# EAGLE design BeeBeeAte-BotBoardV2 (EAGLE 9.6.2)

## Sheet 1 of 4: Power Supply
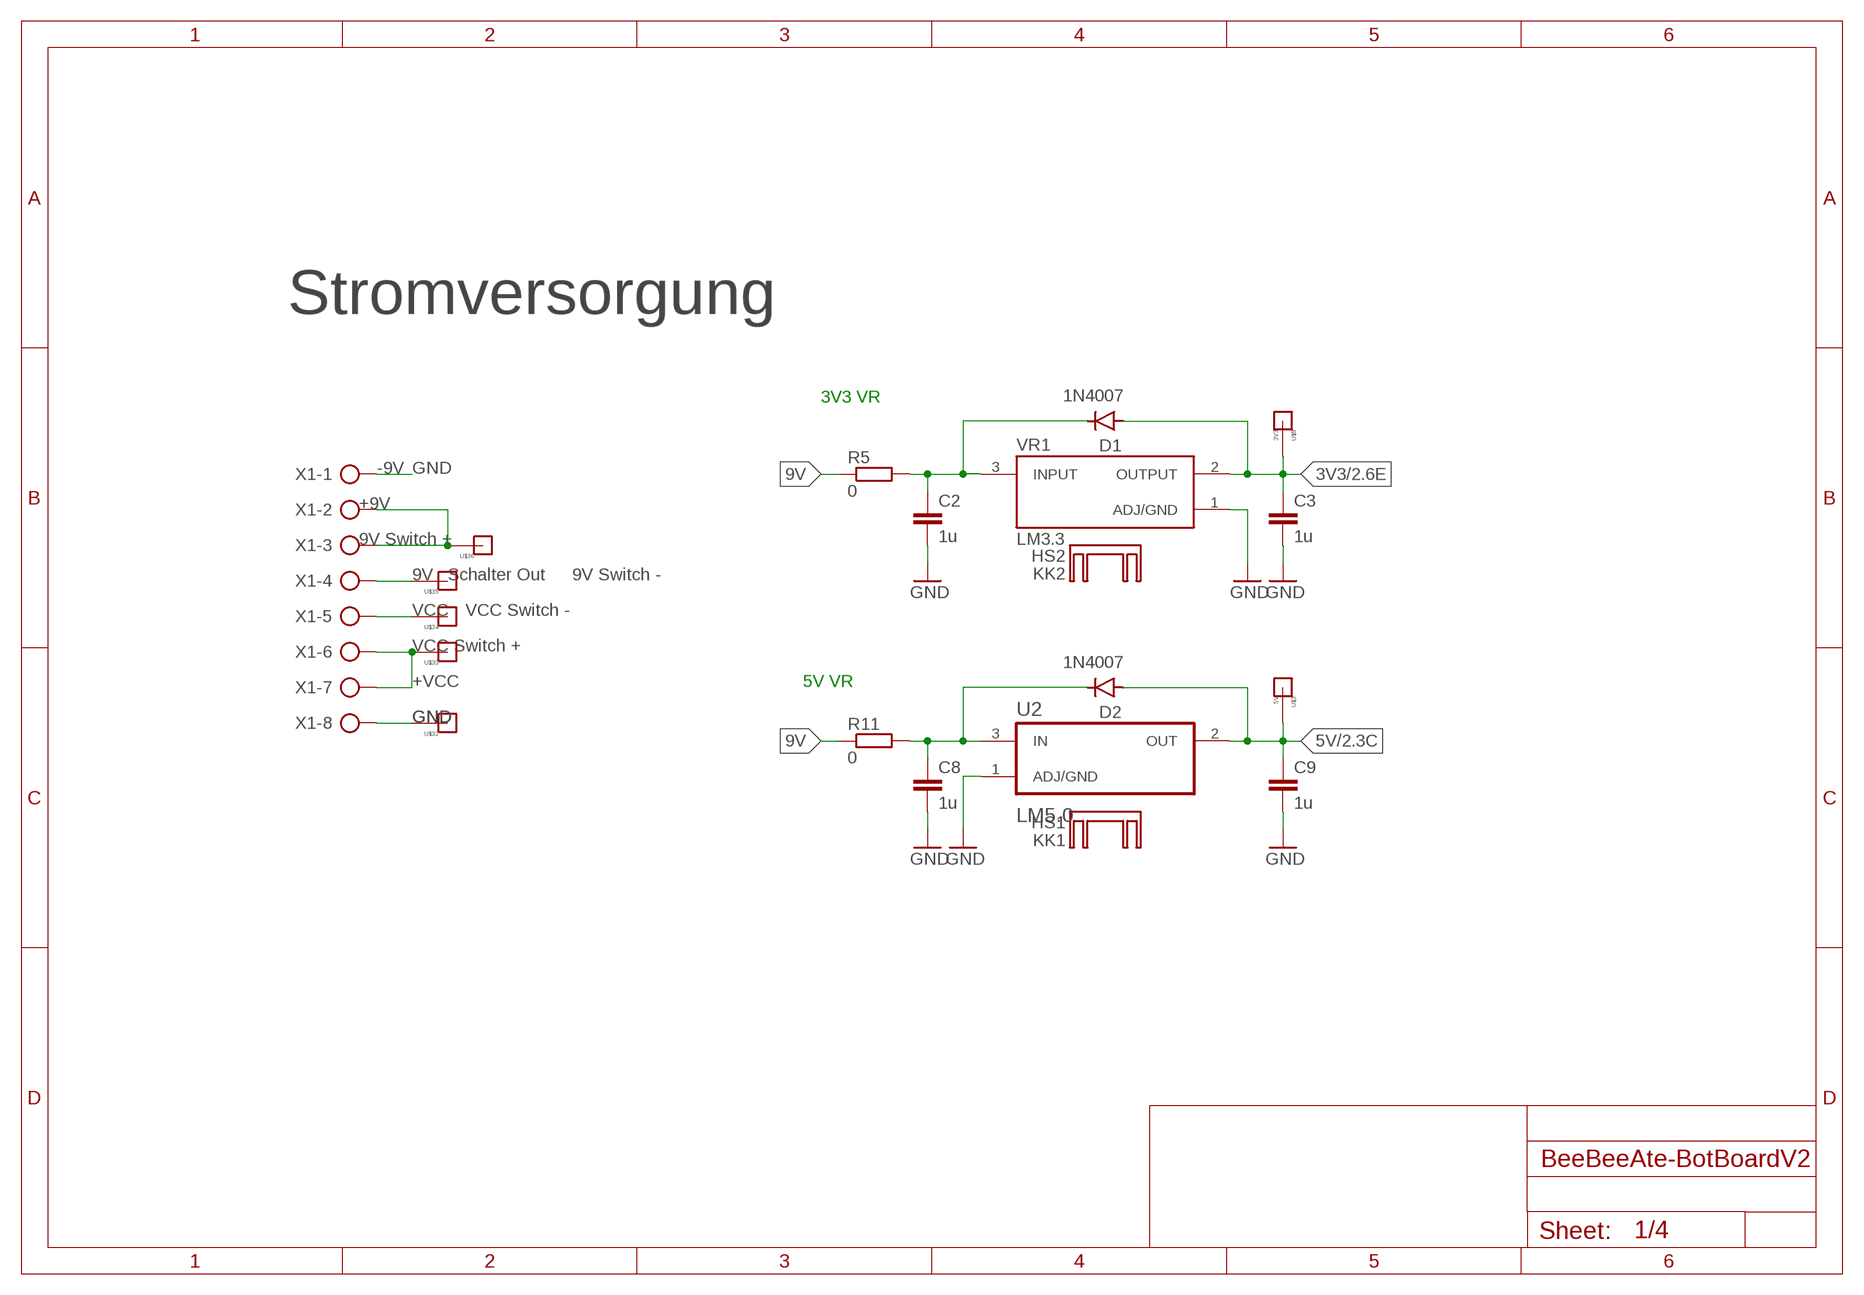
[diagram p0: schematic, sheet 1]

### Parts
C2  1u  C-EUC0805  [C0805]
C3  1u  C-EUC0805  [C0805]
C8  1u  C-EUC0805  [C0805]
C9  1u  C-EUC0805  [C0805]
D1  1N4007  [DO-41]
D2  1N4007  [DO-41]
KK1  HS1  SK95-2M3  [SK95-2M3]
KK2  HS2  SK95-2M3  [SK95-2M3]
R5  0  R-EU_R0805  [R0805]
R11  0  R-EU_R0805  [R0805]
U2  LM5.0  LM1117T-5.0  [TO254P1054X470X1955-3]
U$3  5V  MESSPAD  [MESSPAD]
U$5  3V3  MESSPAD  [MESSPAD]
U$32  MESSPAD  [MESSPAD]
U$33  MESSPAD  [MESSPAD]
U$34  MESSPAD  [MESSPAD]
U$35  MESSPAD  [MESSPAD]
U$36  MESSPAD  [MESSPAD]
VR1  LM3.3  LM1117T-3.3/NOPB  [TO254P1054X470X1955-3]
X1  +9V  AK300/8  [AK300/8]

### Nets
3V3: C3.1 D1.A U$5.MSP VR1.2(OUTPUT) ; also sheet 2,3,4
5V: C9.1 D2.A U2.2(OUT) U$3.MSP ; also sheet 2
9V: R5.1 R11.1 U$35.MSP X1.4
+VCC: U$33.MSP X1.6 X1.7
GND: C2.2 C3.2 C8.2 C9.2 U2.1(ADJ/GND) U$32.MSP VR1.1(ADJ/GND) X1.1 X1.8 ; also sheet 2,3,4
N$4: C2.1 D1.C R5.2 VR1.3(INPUT)
N$8: C8.1 D2.C R11.2 U2.3(IN)
N$46: U$36.MSP X1.2 X1.3
VCC: U$34.MSP X1.5 ; also sheet 3

### Notes on the sheet
- Stromversorgung
- 3V3 VR
- -9V
- +9V
- 9V Switch +
- Schalter Out | 9V Switch -
- VCC Switch -
- VCC Switch +
- +VCC | 5V VR

## Sheet 2 of 4: ESP32 und USB Modul
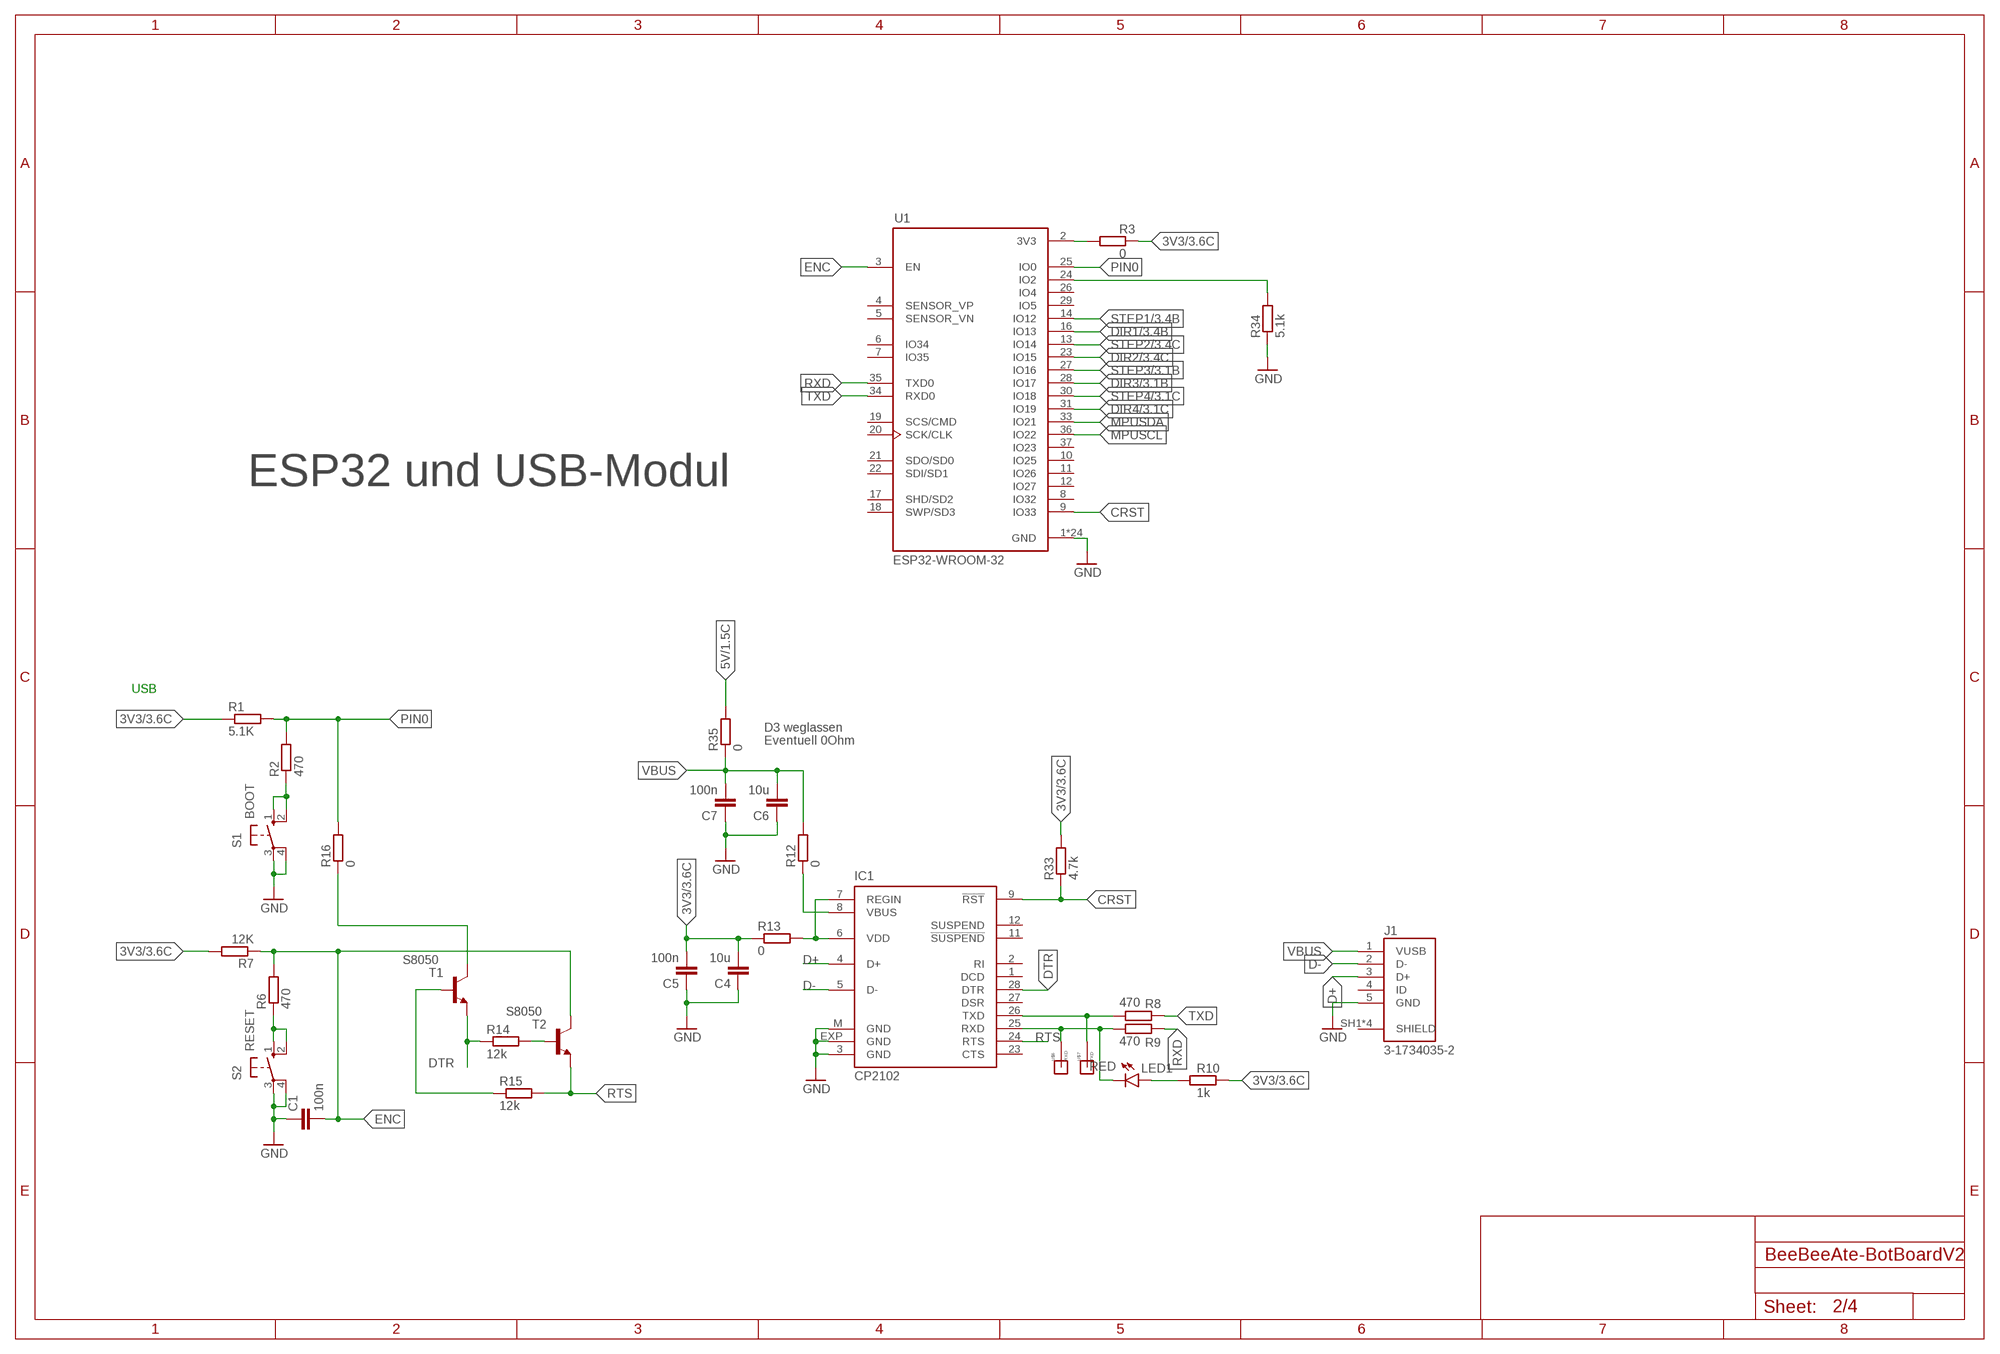
[diagram p1: schematic, sheet 2]

### Parts
C1  100n  C-EUC0805  [C0805]
C4  10u  C-EUC0805  [C0805]
C5  100n  C-EUC0805  [C0805]
C6  10u  C-EUC0805  [C0805]
C7  100n  C-EUC0805  [C0805]
IC1  CP2102  [MLP28]
J1  3-1734035-2  [TE_3-1734035-2]
LED1  RED  LEDCHIP-LED0805  [CHIP-LED0805]
R1  5.1K  R-EU_R0805  [R0805]
R2  470  R-EU_R0805  [R0805]
R3  0  R-EU_R0805  [R0805]
R6  470  R-EU_R0805  [R0805]
R7  12K  R-EU_R0805  [R0805]
R8  470  R-EU_R0805  [R0805]
R9  470  R-EU_R0805  [R0805]
R10  1k  R-EU_R0805  [R0805]
R12  0  R-EU_R0805  [R0805]
R13  0  R-EU_R0805  [R0805]
R14  12k  R-EU_R0805  [R0805]
R15  12k  R-EU_R0805  [R0805]
R16  0  R-EU_R0805  [R0805]
R33  4.7k  R-EU_R0805  [R0805]
R34  5.1k  R-EU_R0805  [R0805]
R35  0  R-EU_R0805  [R0805]
S1  BOOT  10-XX  [B3F-10XX]
S2  RESET  10-XX  [B3F-10XX]
T1  S8050  BC808-NPN-SOT23-BEC  [SOT23-BEC]
T2  S8050  BC808-NPN-SOT23-BEC  [SOT23-BEC]
U1  ESP32-WROOM-32  [MODULE_ESP32-WROOM-32]
U$6  RXD  MESSPAD  [MESSPAD]
U$7  TXD  MESSPAD  [MESSPAD]

### Nets
3V3: C4.2 C5.2 R1.1 R3.2 R7.2 R10.2 R13.1 R33.2 ; also sheet 1,3,4
5V: R35.2 ; also sheet 1
CRST: IC1.9(!RST) R33.1 U1.9(IO33)
D+: IC1.4(D+) J1.3(D+)
D-: IC1.5(D-) J1.2(D-)
DIR1: U1.16(IO13) ; also sheet 3
DIR2: U1.23(IO15) ; also sheet 3
DIR3: U1.28(IO17) ; also sheet 3
DIR4: U1.31(IO19) ; also sheet 3
DTR: IC1.28(DTR) R14.1 T1.E
ENC: C1.2 R6.2 R7.1 T2.C U1.3(EN)
GND: C1.1 C4.1 C5.1 C6.1 C7.1 IC1.3(GND) IC1.EXP(GND) IC1.M(GND) J1.5(GND) R34.1 S1.3(P) S1.4(P1) S2.3(P) S2.4(P1) U1.1(GND) U1.15(GND) U1.38(GND) U1.39_1(GND) U1.39_2(GND) U1.39_3(GND) U1.39_4(GND) U1.39_5(GND) U1.39_6(GND) U1.39_7(GND) U1.39_8(GND) U1.39_9(GND) U1.39_10(GND) U1.39_11(GND) U1.39_12(GND) U1.39_13(GND) U1.39_14(GND) U1.39_15(GND) U1.39_16(GND) U1.39_17(GND) U1.39_18(GND) U1.39_19(GND) U1.39_20(GND) U1.39_21(GND) ; also sheet 1,3,4
MPUSCL: U1.36(IO22) ; also sheet 4
MPUSDA: U1.33(IO21) ; also sheet 4
N$1: R2.1 S1.1(S) S1.2(S1)
N$2: R6.1 S2.1(S) S2.2(S1)
N$6: IC1.25(RXD) LED1.C R9.1 U$6.MSP
N$7: LED1.A R10.1
N$9: IC1.26(TXD) R8.1 U$7.MSP
N$10: IC1.6(VDD) IC1.7(REGIN) R13.2
N$11: IC1.8(VBUS) R12.1
N$12: R14.2 T2.B
N$14: R15.1 T1.B
N$25: R34.2 U1.24(IO2)
N$30: R3.1 U1.2(3V3)
PIN0: R1.2 R2.2 R16.2 U1.25(IO0)
PIN1: R16.1 T1.C
RTS: IC1.24(RTS) R15.2 T2.E
RXD: R9.2 U1.35(TXD0)
STEP1: U1.14(IO12) ; also sheet 3
STEP2: U1.13(IO14) ; also sheet 3
STEP3: U1.27(IO16) ; also sheet 3
STEP4: U1.30(IO18) ; also sheet 3
TXD: R8.2 U1.34(RXD0)
VBUS: C6.2 C7.2 J1.1(VUSB) R12.2 R35.1
Unconnected: IC1.1(DCD) IC1.2(RI) IC1.11(!SUSPEND) IC1.12(SUSPEND) IC1.23(CTS) IC1.27(DSR) J1.4(ID) J1.SH1(SHIELD) J1.SH2(SHIELD) J1.SH3(SHIELD) J1.SH4(SHIELD) U1.4(SENSOR_VP) U1.5(SENSOR_VN) U1.6(IO34) U1.7(IO35) U1.8(IO32) U1.10(IO25) U1.11(IO26) U1.12(IO27) U1.17(SHD/SD2) U1.18(SWP/SD3) U1.19(SCS/CMD) U1.20(SCK/CLK) U1.21(SDO/SD0) U1.22(SDI/SD1) U1.26(IO4) U1.29(IO5) U1.37(IO23)

### Notes on the sheet
- ESP32 und USB-Modul
- USB
- D3 weglassen
- Eventuell 0Ohm

## Sheet 3 of 4: Treiber für Motoren
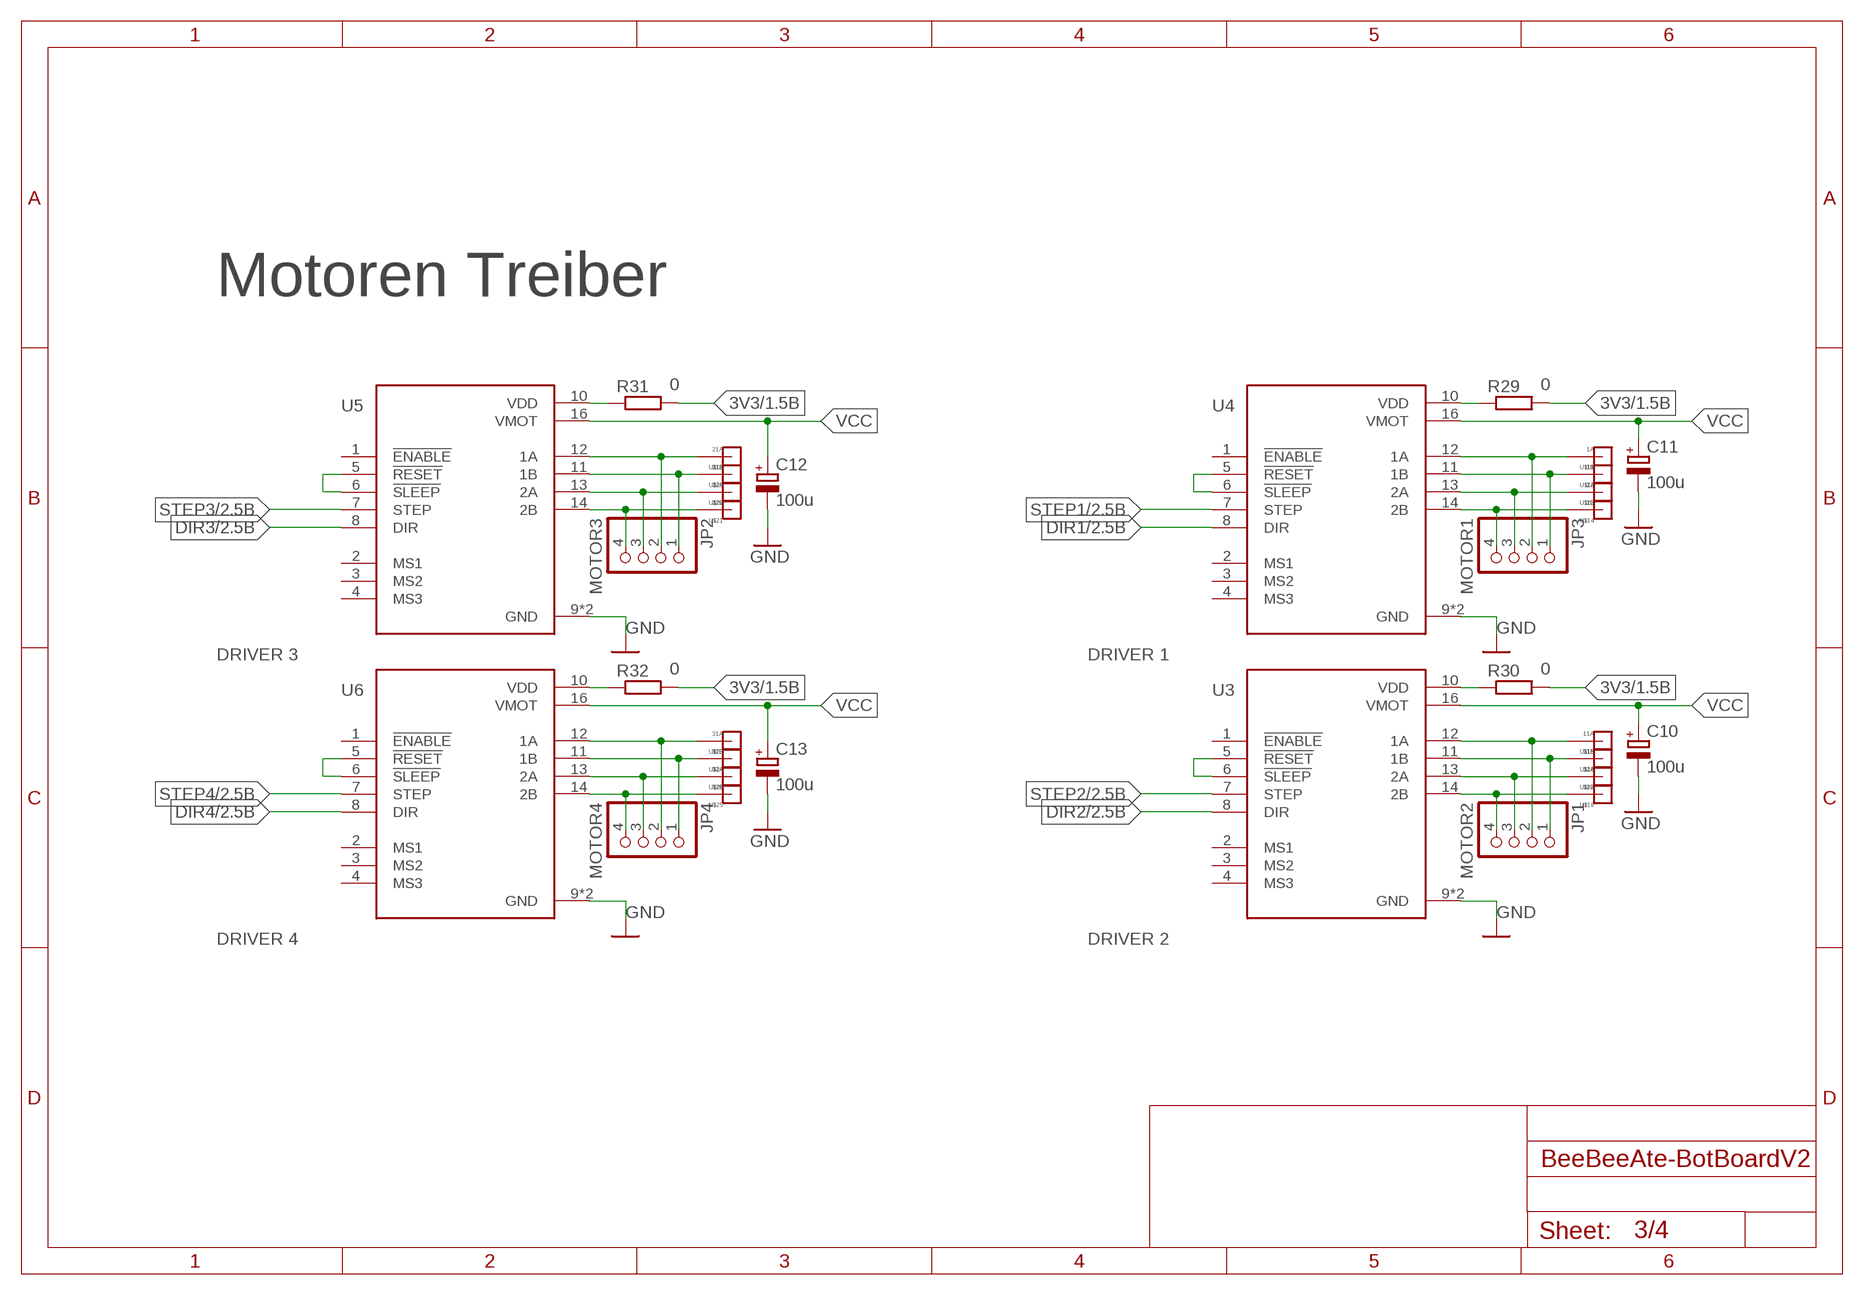
[diagram p2: schematic, sheet 3]

### Parts
C10  100u  CPOL-EU153CLV-0605  [153CLV-0605]
C11  100u  CPOL-EU153CLV-0605  [153CLV-0605]
C12  100u  CPOL-EU153CLV-0605  [153CLV-0605]
C13  100u  CPOL-EU153CLV-0605  [153CLV-0605]
JP1  MOTOR2  PINHD-1X4  [1X04]
JP2  MOTOR3  PINHD-1X4  [1X04]
JP3  MOTOR1  PINHD-1X4  [1X04]
JP4  MOTOR4  PINHD-1X4  [1X04]
R29  0  R-EU_R0805  [R0805]
R30  0  R-EU_R0805  [R0805]
R31  0  R-EU_R0805  [R0805]
R32  0  R-EU_R0805  [R0805]
U3  DRIVER 2  A4988_STEPPER_MOTOR_DRIVER_CARRIER  [MODULE_A4988_STEPPER_MOTOR_DRIVER_CARRIER]
U4  DRIVER 1  A4988_STEPPER_MOTOR_DRIVER_CARRIER  [MODULE_A4988_STEPPER_MOTOR_DRIVER_CARRIER]
U5  DRIVER 3  A4988_STEPPER_MOTOR_DRIVER_CARRIER  [MODULE_A4988_STEPPER_MOTOR_DRIVER_CARRIER]
U6  DRIVER 4  A4988_STEPPER_MOTOR_DRIVER_CARRIER  [MODULE_A4988_STEPPER_MOTOR_DRIVER_CARRIER]
U$11  1A  MESSPAD  [MESSPAD]
U$12  1B  MESSPAD  [MESSPAD]
U$13  2A  MESSPAD  [MESSPAD]
U$14  2B  MESSPAD  [MESSPAD]
U$15  11A  MESSPAD  [MESSPAD]
U$16  11B  MESSPAD  [MESSPAD]
U$17  12A  MESSPAD  [MESSPAD]
U$18  12B  MESSPAD  [MESSPAD]
U$19  21A  MESSPAD  [MESSPAD]
U$20  21B  MESSPAD  [MESSPAD]
U$21  22B  MESSPAD  [MESSPAD]
U$22  22A  MESSPAD  [MESSPAD]
U$23  31A  MESSPAD  [MESSPAD]
U$24  31B  MESSPAD  [MESSPAD]
U$25  32B  MESSPAD  [MESSPAD]
U$26  32A  MESSPAD  [MESSPAD]

### Nets
3V3: R29.2 R30.2 R31.2 R32.2 ; also sheet 1,2,4
DIR1: U4.8(DIR) ; also sheet 2
DIR2: U3.8(DIR) ; also sheet 2
DIR3: U5.8(DIR) ; also sheet 2
DIR4: U6.8(DIR) ; also sheet 2
GND: C10.- C11.- C12.- C13.- U3.9(GND) U3.15(GND) U4.9(GND) U4.15(GND) U5.9(GND) U5.15(GND) U6.9(GND) U6.15(GND) ; also sheet 1,2,4
N$13: R30.1 U3.10(VDD)
N$16: JP1.2 U3.12(1A) U$15.MSP
N$17: JP1.1 U3.11(1B) U$16.MSP
N$18: JP1.3 U3.13(2A) U$17.MSP
N$19: JP1.4 U3.14(2B) U$18.MSP
N$23: U3.5(!RESET) U3.6(!SLEEP)
N$24: R29.1 U4.10(VDD)
N$26: JP2.2 U5.12(1A) U$19.MSP
N$27: JP2.1 U5.11(1B) U$20.MSP
N$28: JP2.3 U5.13(2A) U$22.MSP
N$29: JP2.4 U5.14(2B) U$21.MSP
N$32: JP3.2 U4.12(1A) U$11.MSP
N$33: JP3.1 U4.11(1B) U$12.MSP
N$34: JP3.3 U4.13(2A) U$13.MSP
N$38: U5.5(!RESET) U5.6(!SLEEP)
N$39: R31.1 U5.10(VDD)
N$40: R32.1 U6.10(VDD)
N$41: JP3.4 U4.14(2B) U$14.MSP
N$45: U4.5(!RESET) U4.6(!SLEEP)
N$49: JP4.2 U6.12(1A) U$23.MSP
N$50: JP4.1 U6.11(1B) U$24.MSP
N$51: JP4.3 U6.13(2A) U$26.MSP
N$52: JP4.4 U6.14(2B) U$25.MSP
N$56: U6.5(!RESET) U6.6(!SLEEP)
STEP1: U4.7(STEP) ; also sheet 2
STEP2: U3.7(STEP) ; also sheet 2
STEP3: U5.7(STEP) ; also sheet 2
STEP4: U6.7(STEP) ; also sheet 2
VCC: C10.+ C11.+ C12.+ C13.+ U3.16(VMOT) U4.16(VMOT) U5.16(VMOT) U6.16(VMOT) ; also sheet 1
Unconnected: U3.1(!ENABLE) U3.2(MS1) U3.3(MS2) U3.4(MS3) U4.1(!ENABLE) U4.2(MS1) U4.3(MS2) U4.4(MS3) U5.1(!ENABLE) U5.2(MS1) U5.3(MS2) U5.4(MS3) U6.1(!ENABLE) U6.2(MS1) U6.3(MS2) U6.4(MS3)

### Notes on the sheet
- Motoren Treiber

## Sheet 4 of 4: MPU6050
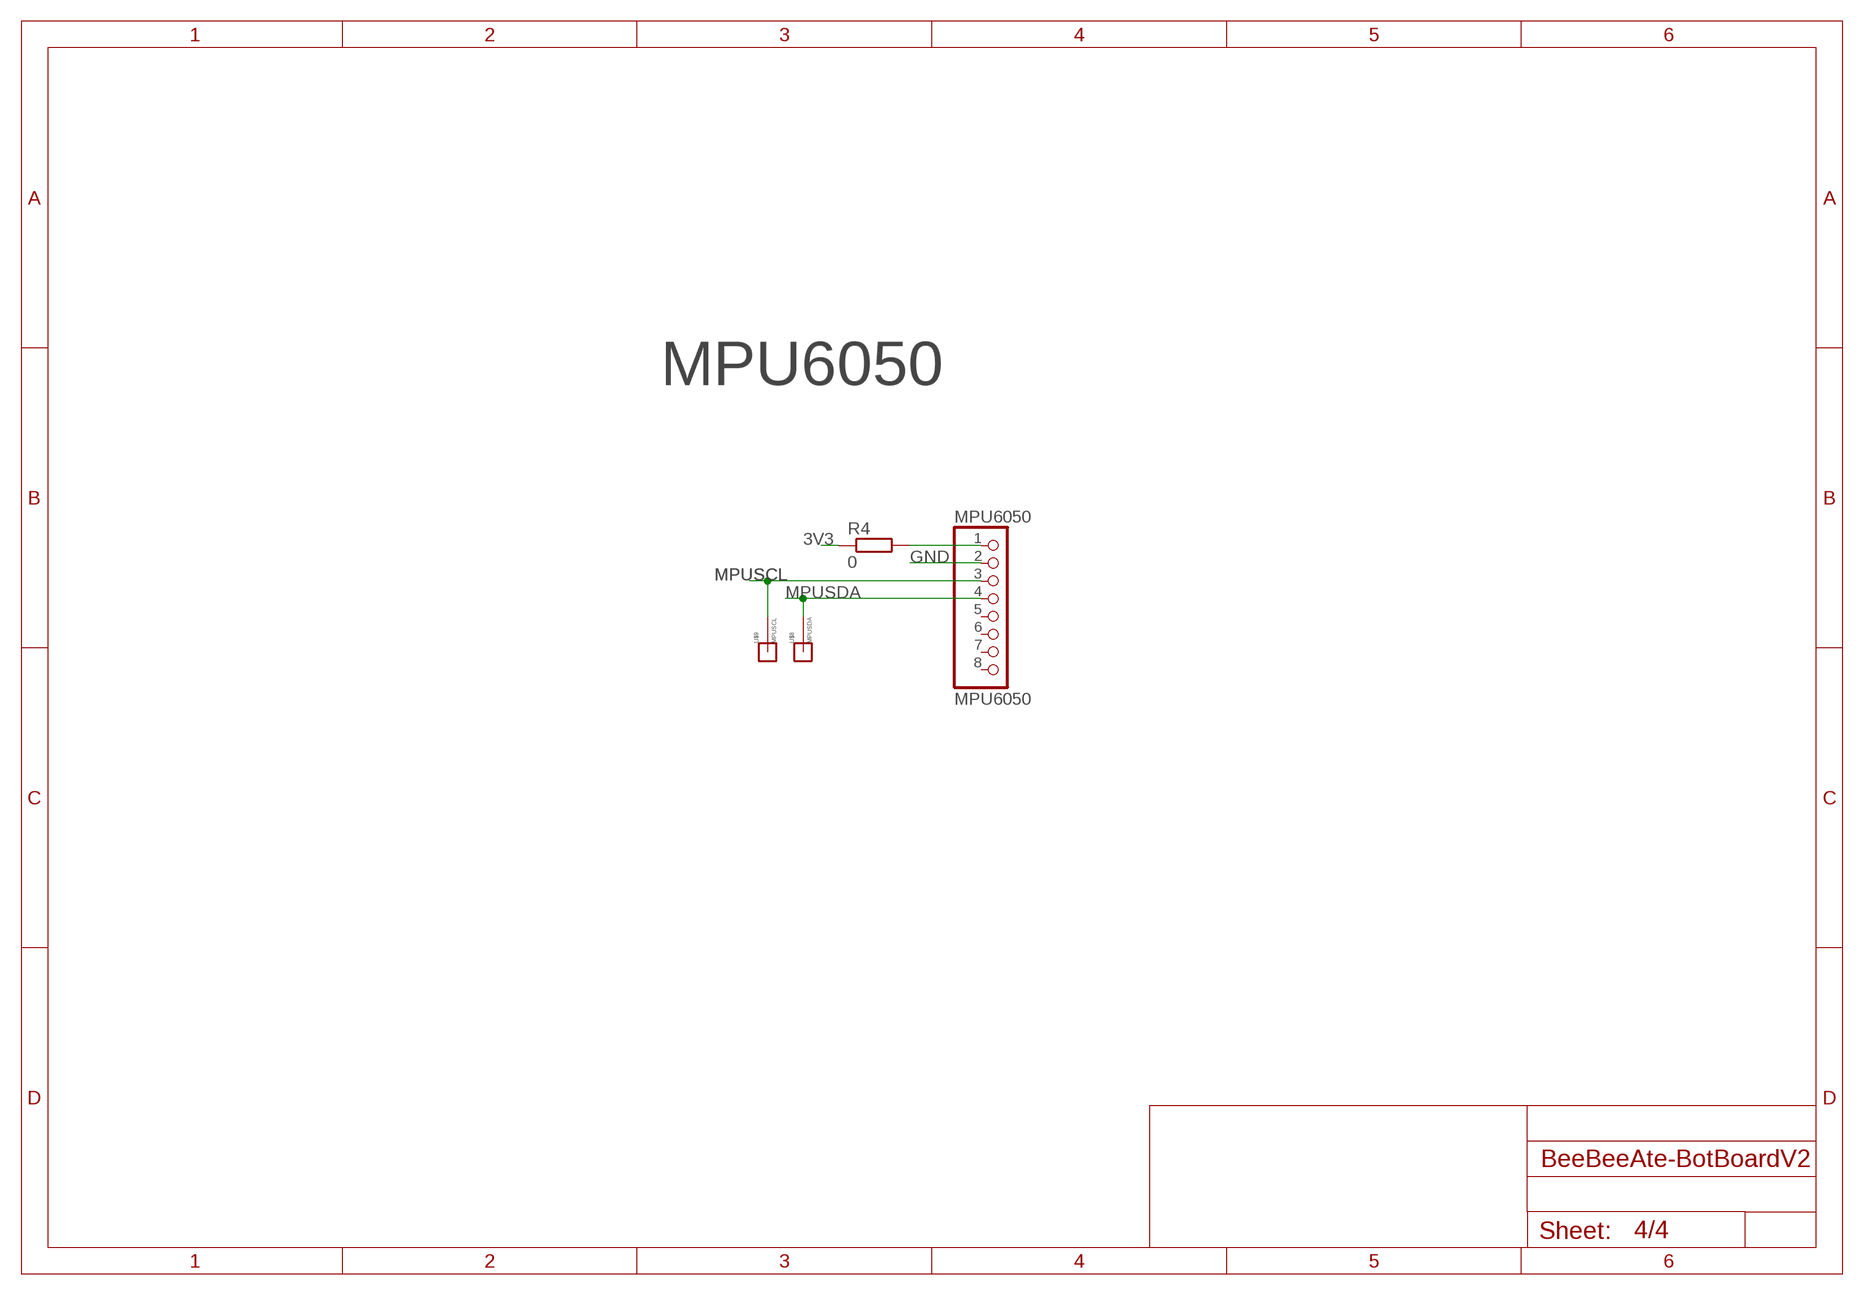
[diagram p3: schematic, sheet 4]

### Parts
MPU6050  MPU6050  PINHD-1X8  [1X08]
R4  0  R-EU_R0805  [R0805]
U$8  MPUSDA  MESSPAD  [MESSPAD]
U$9  MPUSCL  MESSPAD  [MESSPAD]

### Nets
3V3: R4.1 ; also sheet 1,2,3
GND: MPU6050.2 ; also sheet 1,2,3
MPUSCL: MPU6050.3 U$9.MSP ; also sheet 2
MPUSDA: MPU6050.4 U$8.MSP ; also sheet 2
N$3: MPU6050.1 R4.2
Unconnected: MPU6050.5 MPU6050.6 MPU6050.7 MPU6050.8

### Notes on the sheet
- MPU6050

## Library data of the parts
C1-C9 = rcl:C-EU: CAPACITOR, European symbol; SPICEPREFIX: C
C10-C13 = rcl:CPOL-EU: POLARIZED CAPACITOR, European symbol; SPICEPREFIX: C
D1 D2 = Diodes:1N4007: DIODE GEN PURP 1KV 1A DO41 Manufacturer's datasheet <https://www.mccsemi.com/pdf/Products/1N4001-1N4007(DO-41).pdf>; CREATED_BY: PCBLayout.com; DIGIKEY_PART_NUMBER: 1N4007MSCT-ND; MANUFACTURER: Micro Commercial Co; MPN: 1N4007; PACKAGE: DO-41
IC1 = silabs:CP210*: Single-Chip USB to UART Bridge Source: www.silabs.com .. CP2101.pdf / cp2102.pdf; MF: FARNELL; MPN: CP2102-GM; OC_FARNELL: 9282130; OC_NEWARK: 30K5635
J1 = 3-1734035-2:3-1734035-2: USB Connectors MINI USB, R/A, SMT, MATTE TIN, W/O MYLAR Check prices <https://pricing.snapeda.com/parts/3-1734035-2/TE%20Connectivity/view-part?ref=eda>; AVAILABILITY: In Stock; COMMENT: 3-1734035-2; DESCRIPTION: USB Connectors MINI USB, R/A, SMT, MATTE TIN, W/O MYLAR; MF: TE Connectivity; MP: 3-1734035-2; PACKAGE: None; PRICE: None; PURCHASE-URL: https://pricing.snapeda.com/search/part/3-1734035-2/?ref=eda
JP1-JP4 = pinhead:PINHD-1X4: PIN HEADER
KK1 KK2 = heatsink:SK95-2M3: HEATSINK manufacturer Fischer/distributor Buerklin
LED1 = led:LED: LED OSRAM: - CHIPLED LG R971, LG N971, LY N971, LG Q971, LY Q971, LO R971, LY R971 LH N974, LH R974 LS Q976, LO Q976, LY Q976 LO Q996 - Hyper CHIPLED LW Q18S LB Q993, LB Q99A, LB R99A - SideLED LS A670, LO A670, LY A670, LG A670, LP A670 LB A673, LV A673, LT A673, LW A673 LH A674 LY A675 LS A676, LA A676, LO A676, LY A676, LW A676 LS A679, LY A679, LG A679 - Hyper Micro SIDELED® LS Y876, LA Y876, LO Y876, LY Y876 LT Y87S - SmartLED LW L88C, LW L88S LB L89C, LB L89S, LG L890 LS L89K, LO L89K, LY L89K LS L896, LA L896, LO L896, LY L896 - TOPLED LS T670, LO T670, LY T670, LG T670, LP T670 LSG T670, LSP T670, LSY T670, LOP T670, LYG T670 LG T671, LOG T671, LSG T671 LB T673, LV T673, LT T673, LW T673 LH T674 LS T676, LA T676, LO T676, LY T676, LB T676, LH T676, LSB T676, LW T676 LB T67C, LV T67C, LT T67C, LS T67K, LO T67K, LY T67K, LW E67C LS E67B, LA E67B, LO E67B, LY E67B, LB E67C, LV E67C, LT E67C LW T67C LS T679, LY T679, LG T679 LS T770, LO T770, LY T770, LG T770, LP T770 LB T773, LV T773, LT T773, LW T773 LH T774 LS E675, LA E675, LY E675, LS T675 LS T776, LA T776, LO T776, LY T776, LB T776 LHGB T686 LT T68C, LB T68C - Hyper Mini TOPLED® LB M676 - Mini TOPLED Santana® LG M470 LS M47K, LO M47K, LY M47K Source: http://www.osram.convergy.de LUXEON: - LUMILED® LXK2-PW12-R00, LXK2-PW12-S00, LXK2-PW14-U00, LXK2-PW14-V00 LXK2-PM12-R00, LXK2-PM12-S00, LXK2-PM14-U00 LXK2-PE12-Q00, LXK2-PE12-R00, LXK2-PE12-S00, LXK2-PE14-T00, LXK2-PE14-U00 LXK2-PB12-K00, LXK2-PB12-L00, LXK2-PB12-M00, LXK2-PB14-N00, LXK2-PB14-P00, LXK2-PB14-Q00 LXK2-PR12-L00, LXK2-PR12-M00, LXK2-PR14-Q00, LXK2-PR14-R00 LXK2-PD12-Q00, LXK2-PD12-R00, LXK2-PD12-S00 LXK2-PH12-R00, LXK2-PH12-S00 LXK2-PL12-P00, LXK2-PL12-Q00, LXK2-PL12-R00 Source: www.luxeon.com KINGBRIGHT: KA-3528ASYC Source: www.kingbright.com
MPU6050 = pinhead:PINHD-1X8: PIN HEADER
R1-R16 R29-R35 = rcl:R-EU_: RESISTOR, European symbol; SPICEPREFIX: R
S1 S2 = switch-omron:10-XX: OMRON SWITCH; MPN: B3F-1000; OC_FARNELL: 176432; OC_NEWARK: 36M3542
T1 T2 = transistor:*-NPN-: NPN Transistror BF959 corrected 2008.03.06
U1 = ESP32-WROOM-32:ESP32-WROOM-32: Bluetooth, WiFi Transceiver Module 2.4GHz ~ 2.5GHz Surface Mount Check prices <https://pricing.snapeda.com/parts/ESP32-WROOM-32/Espressif%20Systems/view-part?ref=eda>; AVAILABILITY: In Stock; DESCRIPTION: Bluetooth, WiFi 802.11b/g/n, Bluetooth v4.2 +EDR, Class 1, 2 and 3 Transceiver Module 2.4GHz ~ 2.5GHz Antenna Not Included, U.FL Surface Mount; MF: Espressif Systems; MP: ESP32-WROOM-32; PACKAGE: Module Espressif Systems; PRICE: None; PURCHASE-URL: https://pricing.snapeda.com/search/part/ESP32-WROOM-32/?ref=eda
U2 = LM1117T-5.0:LM1117T-5.0: Check prices <https://pricing.snapeda.com/parts/LM1117T-5.0/NOPB/Texas%20Instruments/view-part?ref=eda>; AVAILABILITY: In Stock; DESCRIPTION: 800-mA 15-V linear voltage regulator 3-TO-220 0 to 125; MF: Texas Instruments; MP: LM1117T-5.0/NOPB; PACKAGE: TO-220-3 Texas Instruments; PRICE: None; PURCHASE-URL: https://pricing.snapeda.com/search/part/LM1117T-5.0/NOPB/?ref=eda
U3-U6 = A4988_STEPPER_MOTOR_DRIVER_CARRIER:A4988_STEPPER_MOTOR_DRIVER_CARRIER: Stepper motor controler; IC: A4988; 1A; Uin mot: 8÷35V Check prices <https://pricing.snapeda.com/parts/A4988%20STEPPER%20MOTOR%20DRIVER%20CARRIER/Pololu/view-part?ref=eda>; AVAILABILITY: Not in stock; DESCRIPTION: Stepper Motor Driver; MF: Pololu; MP: A4988 STEPPER MOTOR DRIVER CARRIER; PACKAGE: None; PRICE: None
U$3 U$5-U$9 U$11-U$26 U$32-U$36 = 03lanfra-PADS:MESSPAD
VR1 = LM1117T-3.3:LM1117T-3.3/NOPB: Check prices <https://pricing.snapeda.com/parts/LM1117T-3.3/NOPB/Texas%20Instruments/view-part?ref=eda>; AVAILABILITY: In Stock; DESCRIPTION: 800-mA 15-V linear voltage regulator 3-TO-220 0 to 125; MF: Texas Instruments; MP: LM1117T-3.3/NOPB; PACKAGE: TO-220-3 Texas Instruments; PRICE: None; PURCHASE-URL: https://pricing.snapeda.com/search/part/LM1117T-3.3/NOPB/?ref=eda
X1 = con-ptr500:AK300/8: CONNECTOR; OC_FARNELL: unknown; OC_NEWARK: unknown

## Board
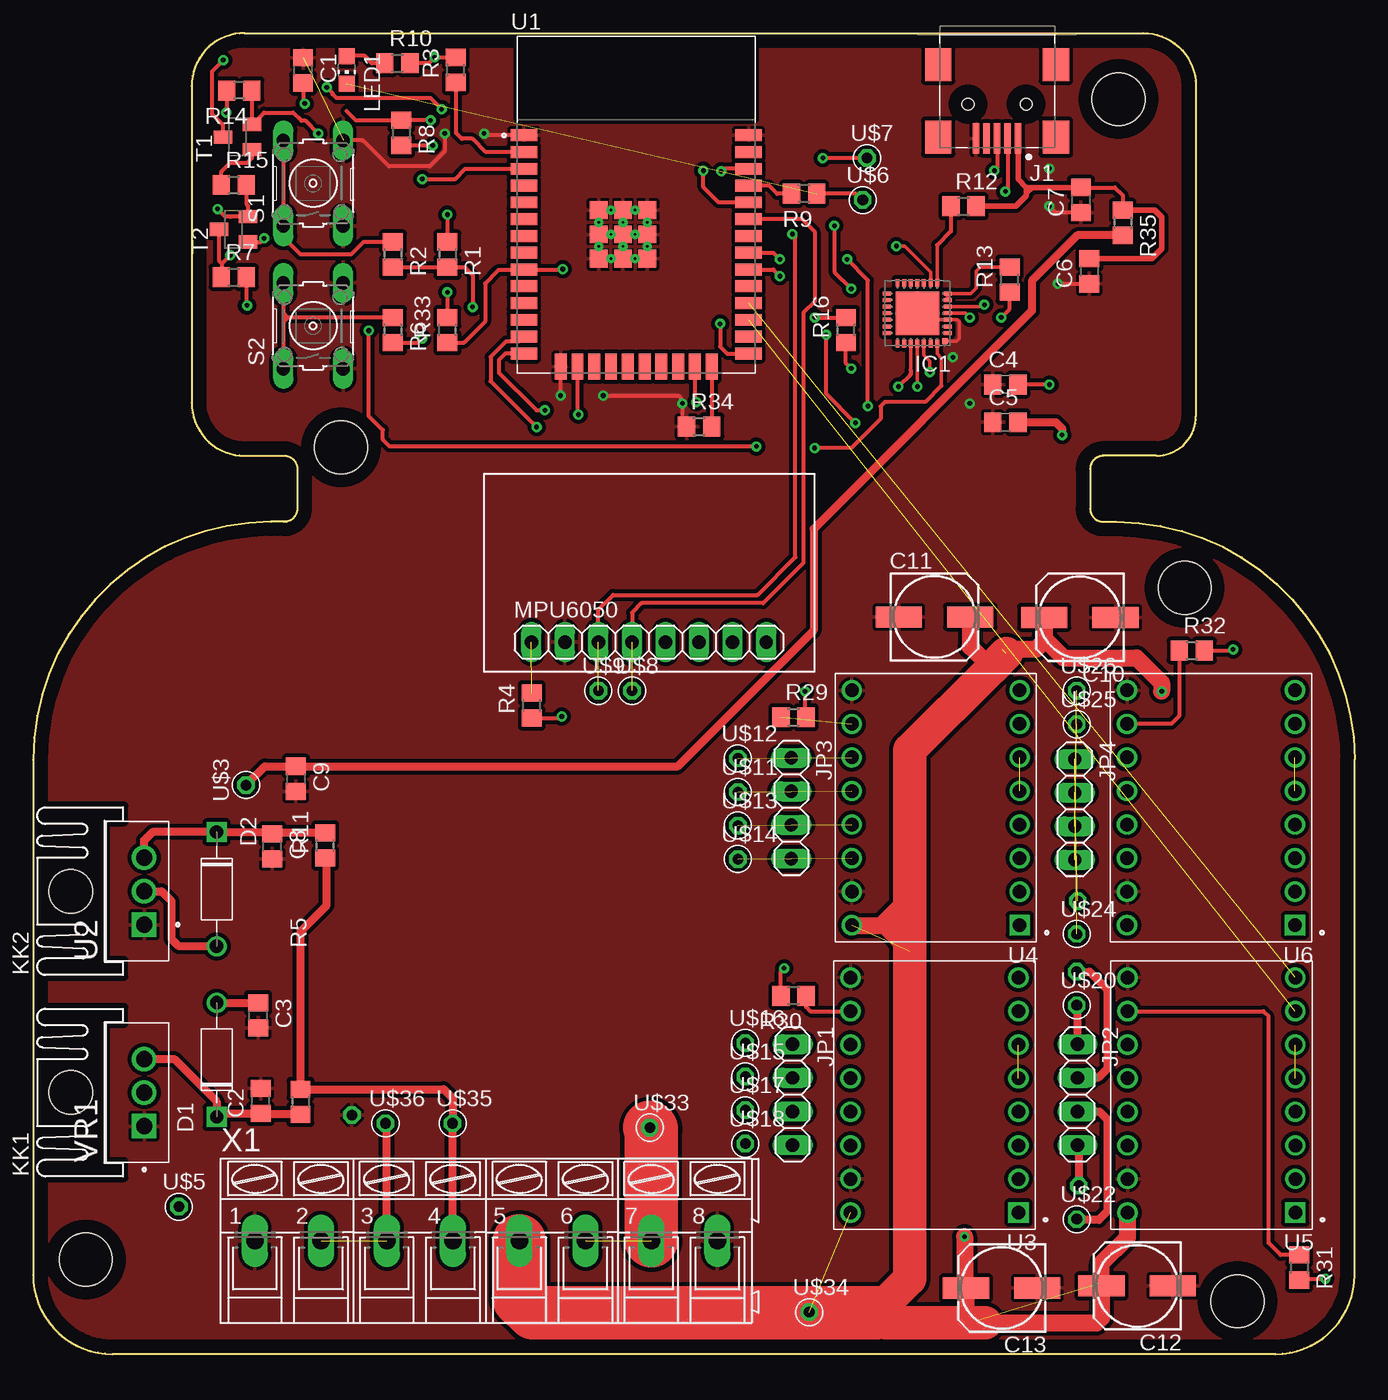
[diagram p4: board, top side]
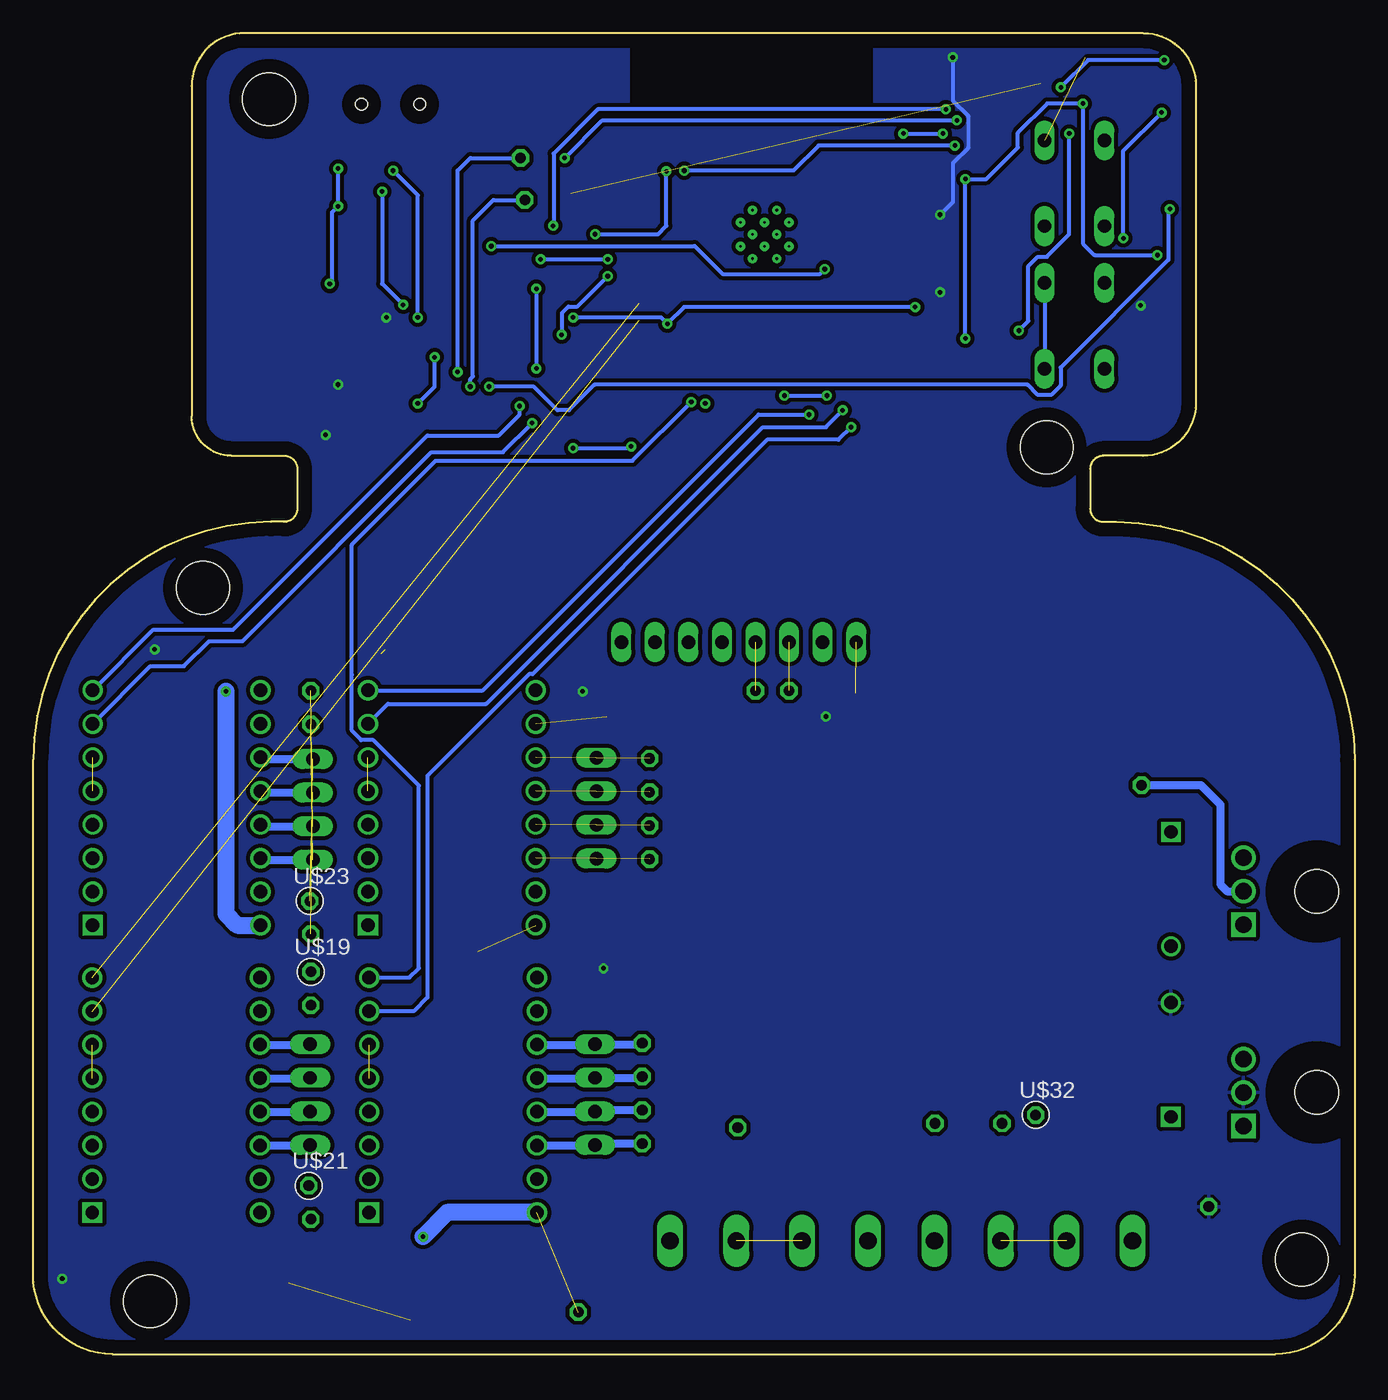
[diagram p5: board, bottom side, seen from below]

Size 100 x 100 mm. Coordinates in mm from the lower left corner, seen from the top.
Outline: 16,100 arc90 12,96 12,72 arc90 16,68 19,68 arc-90 20,67 20,64 arc-90 19,63 18,63 arc90 0,45 0,6 arc90 6,0 94,0 arc90 100,6 100,45 arc90 82,63 81,63 arc-90 80,64 80,67 arc-90 81,68 85,68 arc90 88,71 88,96 arc90 84,100 16,100
Copper layers (1*16): Top 0.035mm / dielectric 1.5mm / Bottom 0.035mm
Design rules "default *": minimum track width 6mil, minimum drill 0.35mm, track to track 12mil, track to pad 12mil, pad to pad 12mil, via to via 12mil, smd to smd 12mil, copper to edge 40mil, drill to drill 12mil, minimum pad ring 10mil, minimum via ring 8mil, stop-mask expansion 4mil, vias tented up to drill 0mil, thermal gap 10mil
Holes 4 mm at 3.98,7.16 87.14,58 82.14,95 23.3,68.64 91.14,4

### Footprints (pad centres in the part's own frame; a part is rotated, then mirrored left to right if it is on the bottom)
C0805 = smd 1.3 x 1.5: 1 -0.95,0; 2 0.95,0
153CLV-0605 = smd 3.5 x 1.6: + 2.7,0; - -2.7,0
DO-41 = drill 1: A 4.325,0 | drill 1 square: C -4.325,0
MLP28 = smd 0.6 x 0.3: 1 -2.3,1.5; 2 -2.3,1; 3 -2.3,0.5; 4 -2.3,0; 5 -2.3,-0.5; 6 -2.3,-1; 7 -2.3,-1.5; 15 2.3,-1.5; 16 2.3,-1; 17 2.3,-0.5; 18 2.3,0; 19 2.3,0.5; 20 2.3,1; 21 2.3,1.5 | smd 0.3 x 0.6: 8 -1.5,-2.3; 9 -1,-2.3; 10 -0.5,-2.3; 11 0,-2.3; 12 0.5,-2.3; 13 1,-2.3; 14 1.5,-2.3; 22 1.5,2.3; 23 1,2.3; 24 0.5,2.3; 25 0,2.3; 26 -0.5,2.3; 27 -1,2.3; 28 -1.5,2.3 | smd 3.3 x 3.3: EXP 0,0 | smd 0.435 x 0.435: M -2.103,2.103
TE_3-1734035-2 = smd 0.5 x 2.3: 1 -1.6,2.6; 2 -0.8,2.6; 3 0,2.6; 4 0.8,2.6; 5 1.6,2.6 | smd 2 x 2.5: SH1 -4.45,2.5; SH2 4.45,2.5; SH3 -4.45,-3; SH4 4.45,-3 | hole 0.9: -2.2,0; 2.2,0
1X04 = drill 1.016 long: 1 -3.81,0; 2 -1.27,0; 3 1.27,0; 4 3.81,0
SK95-2M3 = hole 3.302: 0,2.54
CHIP-LED0805 = smd 1.2 x 1.2: A 0,-1.05; C 0,1.05
1X08 = drill 1.016 long: 1 -8.89,0; 2 -6.35,0; 3 -3.81,0; 4 -1.27,0; 5 1.27,0; 6 3.81,0; 7 6.35,0; 8 8.89,0
R0805 = smd 1.3 x 1.5: 1 -0.95,0; 2 0.95,0
B3F-10XX = drill 1.016 long: 1 -3.251,2.261; 2 3.251,2.261; 3 -3.251,-2.261; 4 3.251,-2.261
SOT23-BEC = smd 1 x 1.4: B -0.95,-1.1; C 0,1.1; E 0.95,-1.1
MODULE_ESP32-WROOM-32 = smd 2 x 0.9: 1 -8.5,5.26; 2 -8.5,3.99; 3 -8.5,2.72; 4 -8.5,1.45; 5 -8.5,0.18; 6 -8.5,-1.09; 7 -8.5,-2.36; 8 -8.5,-3.63; 9 -8.5,-4.9; 10 -8.5,-6.17; 11 -8.5,-7.44; 12 -8.5,-8.71; 13 -8.5,-9.98; 14 -8.5,-11.25; 25 8.5,-11.25; 26 8.5,-9.98; 27 8.5,-8.71; 28 8.5,-7.44; 29 8.5,-6.17; 30 8.5,-4.9; 31 8.5,-3.63; 32 8.5,-2.36; 33 8.5,-1.09; 34 8.5,0.18; 35 8.5,1.45; 36 8.5,2.72; 37 8.5,3.99; 38 8.5,5.26 | smd 0.9 x 2: 15 -5.715,-12.25; 16 -4.445,-12.25; 17 -3.175,-12.25; 18 -1.905,-12.25; 19 -0.635,-12.25; 20 0.635,-12.25; 21 1.905,-12.25; 22 3.175,-12.25; 23 4.445,-12.25; 24 5.715,-12.25 | smd 1.33 x 1.33: 39_1 -2.835,-0.405; 39_2 -1,-0.405; 39_3 0.835,-0.405; 39_4 -2.835,-2.24; 39_5 -1,-2.24; 39_6 0.835,-2.24; 39_7 -2.835,-4.075; 39_8 -1,-4.075; 39_9 0.835,-4.075 | drill 0.2 pad 0.3: 39_10 -1.917,-0.405; 39_11 -0.083,-0.405; 39_12 -2.835,-1.323; 39_13 -1,-1.323; 39_14 0.835,-1.323; 39_15 -1.917,-2.24; 39_16 -0.083,-2.24; 39_17 -2.835,-3.158; 39_18 -1,-3.158; 39_19 0.835,-3.158; 39_20 -1.917,-4.075; 39_21 -0.083,-4.075
TO254P1054X470X1955-3 = drill 1.24 square: 1 -2.54,0 | drill 1.24: 2 0,0; 3 2.54,0
MODULE_A4988_STEPPER_MOTOR_DRIVER_CARRIER = drill 1.02 square: 1 -6.35,8.89 | drill 1.02: 2 -6.35,6.35; 3 -6.35,3.81; 4 -6.35,1.27; 5 -6.35,-1.27; 6 -6.35,-3.81; 7 -6.35,-6.35; 8 -6.35,-8.89; 9 6.35,-8.89; 10 6.35,-6.35; 11 6.35,-3.81; 12 6.35,-1.27; 13 6.35,1.27; 14 6.35,3.81; 15 6.35,6.35; 16 6.35,8.89
MESSPAD = drill 0.8 octagon: MSP 0,0
AK300/8 = drill 1.321 long: 1 -17.501,0; 2 -12.497,0; 3 -7.518,0; 4 -2.515,0; 5 2.515,0; 6 7.518,0; 7 12.497,0; 8 17.501,0

### Placement (x,y rotation side)
C1  20.43,97.17 270 top
C2  17.22,19.16 90 top
C3  17.03,25.64 270 top
C4  73.58,73.39 0 top
C5  73.58,70.53 0 top
C6  79.93,81.96 90 top
C7  79.3,87.36 90 top
C8  18.1,38.42 270 top
C9  19.89,43.54 270 top
C10  79.22,55.77 180 top
C11  68.22,55.8 0 top
C12  83.55,5.16 180 top
C13  73.3,5 180 top
D1  13.89,22.27 90 top
D2  13.89,35.2 270 top
IC1  66.92,78.79 180 top
J1  72.95,94.61 180 top
JP1  57.48,19.64 270 top
JP2  79.03,19.64 270 top
JP3  57.38,41.32 270 top
JP4  78.83,41.23 270 top
KK1  5.4,19.8 90 top
KK2  5.4,35.04 90 top
LED1  23.73,97.2 180 top
MPU6050  46.59,53.9 0 top
R1  31.36,83.23 270 top
R2  27.23,83.23 270 top
R3  31.99,97.2 90 top
R4  37.73,49.09 90 top
R5  20.24,19.1 270 top
R6  27.23,77.52 270 top
R7  15.19,81.52 0 top
R8  27.86,92.44 270 top
R9  58.34,87.84 180 top
R10  27.57,97.71 0 top
R11  22.11,38.49 90 top
R12  70.41,86.88 0 top
R13  73.9,81.33 90 top
R14  15.61,95.64 180 top
R15  15.19,88.5 0 top
R16  61.52,77.52 90 top
R29  57.55,48.21 0 top
R30  57.55,27.11 180 top
R31  95.81,6.56 270 top
R32  87.68,53.26 0 top
R33  31.36,77.52 90 top
R34  50.41,70.22 0 top
R35  82.45,85.63 270 top
S1  21.2,88.63 90 top
S2  21.2,77.83 90 top
T1  15.48,92.12 90 top
T2  15.16,85.14 90 top
U1  45.64,87 0 top
U2  8.41,35.04 90 top
U3  68.22,19.61 180 top
U4  68.31,41.35 180 top
U5  89.17,19.61 180 top
U6  89.14,41.35 180 top
U$3  16.11,43.07 90 top
U$5  11.04,11.16 0 top
U$6  62.79,87.36 0 top
U$7  63.1,90.53 0 top
U$8  45.33,50.21 0 top
U$9  42.78,50.21 0 top
U$11  53.34,42.55 0 top
U$12  53.34,45.09 0 top
U$13  53.34,40.01 0 top
U$14  53.34,37.47 0 top
U$15  53.9,21 0 top
U$16  53.9,23.54 0 top
U$17  53.9,18.46 0 top
U$18  53.9,15.92 0 top
U$19  78.98,28.94 0 bottom
U$20  78.98,26.4 0 top
U$21  79.14,12.75 0 bottom
U$22  78.98,10.21 0 top
U$23  79.06,34.29 0 bottom
U$24  78.98,31.8 0 top
U$25  78.98,47.67 0 top
U$26  78.98,50.21 0 top
U$32  24.13,18.1 0 bottom
U$33  46.67,17.14 0 top
U$34  58.74,3.17 0 top
U$35  31.75,17.46 0 top
U$36  26.67,17.46 0 top
VR1  8.41,19.8 90 top
X1  34.29,8.57 0 top

### Tracks (layer width: path | path; a pad name or v marks a point on that pad's centre or on a via)
3V3  (via drill 0.35)
  Top 0.305: R3.2 v30.4,98.16 29.96,97.71 R10.2 | v31.36,80.38 R33.2 | v31.36,86.25 R1.1 | v73.27,78.47 73.9,79.11 R13.1 | v76.92,73.39 C4.2 | R7.2 16.14,79.42 v16.19,79.38 | R29.2 58.42,48.29 v58.42,50.16 | R30.2 56.59,28.97 v56.83,29.21 | R31.2 95.92,5.71 v97.79,5.71 | R32.2 90.72,53.26 v90.81,53.34 | R4.1 39.88,48.14 v40.01,48.26
  Top 0.61: C5.2 77.39,70.53 77.87,70.06 v77.87,69.58 | D1.A C3.1
  Bottom 0.305: v31.36,86.25 30.4,87.2 30.4,90.15 29.25,91.3 29.25,93.74 30.4,94.89 v30.4,98.16
  pour Bottom (isolate 0.305): 15.88,99.22 arc90 12.86,96.2 12.86,96.04 12.86,71.91 arc90 16.03,68.74 19.05,68.74 arc-90 20.8,66.99 20.8,63.98 arc-90 19.05,62.23 17.78,62.23 arc90 0.79,45.24 0.79,45.09 0.79,5.87 arc90 5.87,0.79 6.03,0.79 93.82,0.79 93.98,0.79 94.14,0.79 arc90 99.22,5.87 99.22,44.93 99.22,45.09 arc90 82.07,62.23 80.96,62.23 arc-90 79.22,63.98 79.22,66.99 arc-90 80.96,68.74 85.09,68.74 arc90 87.15,70.8 87.15,70.96 87.15,96.04 87.15,96.2 arc90 84.14,99.22
  cutout Bottom: 54.77,99.22 54.77,93.5 54.61,93.34 36.67,93.34 36.51,93.5 36.51,99.69 54.77,99.69
5V
  Top 0.61: R35.2 79.02,84.68 75.58,81.25 75.58,78.97 59.06,62.45 59.06,54.77 48.74,44.45 19.93,44.45 C9.1 17.54,44.49 U$3.MSP | D2.A 11.04,30.87 10.48,31.43 10.48,34.29 9.73,35.04 U2.2
  Bottom 0.61: U$3.MSP 11.64,43.07 10.16,41.59 10.16,35.56 9.64,35.04 U2.2
9V
  Top 0.61: X1.4 31.77,17.44 | 31.77,17.44 U$35.MSP | 31.77,17.44 31.77,19.34 31.07,20.05 R5.1 20.24,31.99 22.23,33.97 22.23,37.43 R11.1
+VCC  (1 unrouted)
  Top 4.064: X1.7 46.79,17.03 U$33.MSP
CRST  (via drill 0.35)
  Top 0.254: IC1.9 67.92,81.92 65.96,83.87 v65.33,83.87
  Top 0.305: R33.1 32.63,76.57 34.21,78.15 34.21,81.04 35.24,82.07 37.12,82.07 U1.9 40.06,82.09 v40.09,82.12
  Bottom 0.305: v65.33,83.87 49.93,83.87 47.82,81.76 40.45,81.76 v40.09,82.12
D+  (via drill 0.35)
  Top 0.254: IC1.4 70.57,78.79 v70.88,78.47
  Top 0.305: J1.3 72.95,89.78 v72.75,89.58
  Bottom 0.305: v70.88,78.47 70.88,87.71 v72.75,89.58
D-  (via drill 0.35)
  Top 0.254: 71.86,79.29 IC1.5
  Top 0.305: J1.2 73.75,88.16 v73.58,88 | 71.86,79.29 v72,79.42
  Bottom 0.305: v73.58,88 73.58,81.01 v72,79.42
DIR1  (via drill 0.35)
  Top 0.305: U1.16 41.2,71.2 v41.27,71.12
  Bottom 0.305: U4.8 65.96,50.24 45.09,71.12 v41.27,71.12
DIR2  (via drill 0.35)
  Top 0.305: U1.23 50.09,72.18 v50.2,72.07
  Bottom 0.305: U3.8 71.52,28.5 70.8,29.21 70.8,43.03 74.25,46.48 75.17,46.48 75.88,47.2 75.88,51.44 | 75.88,51.44 | 75.88,51.44 75.88,61.28 69.53,67.63 54.64,67.63 v50.2,72.07
DIR3  (1 unrouted)
DIR4  (via drill 0.35)
  Top 0.305: v63.18,71.75 63.18,81.28 v61.59,82.87 | U1.31 56.02,83.36 v56.52,82.87
  Bottom 0.305: U6.8 90.9,54.83 84.87,54.83 70.17,69.53 64.77,69.53 63.18,71.12 v63.18,71.75 | v61.59,82.87 v56.52,82.87
DTR  (via drill 0.35)
  Top 0.254: IC1.28 68.42,75.73 68.74,75.41 68.74,73.31 68.73,73.3
  Top 0.305: R14.1 16.55,93.1 T1.E 17.49,93.98 19.68,93.98 20.32,93.34 20.64,93.34 v21.59,92.39 | 68.73,73.3 67.5,72.07 64.45,72.07 64.14,71.75 64.14,70.8 61.91,68.58 v59.14,68.58 59.05,68.58 | v54.74,68.71 26.98,68.71 26.47,69.22 26.47,69.95 25.4,71.02 v25.4,77.47
  Bottom 0.305: v59.14,68.58 54.87,68.58 v54.74,68.71 | v25.4,77.47 24.68,78.19 24.68,82.35 23.96,83.07 23.28,83.07 21.59,84.76 v21.59,92.39
ENC  (via drill 0.35)
  Top 0.305: C1.2 20.43,94.79 v20.56,94.66 | R6.2 29.14,76.57 v29.45,76.88 | U1.3 32.7,89.72 31.93,88.95 v29.45,88.95 | T2.C 14.06,82.78 14.29,82.55 | 14.29,82.55 14.29,81.56 R7.1 | v14.92,83.19 14.29,82.55
  Bottom 0.305: v29.45,76.88 v29.45,88.95 27.86,88.95 25.48,91.33 25.48,92.44 23.26,94.66 v20.56,94.66 20.56,84.06 19.68,83.19 v14.92,83.19
GND  (via drill 0.35)  (1 unrouted)
  Top 0.254: IC1.M 69.89,76.69 70.09,76.88 70.09,78.15 69.95,78.29 IC1.3 67.42,78.29
  Top 0.305: R34.1 49.13,70.53 v49.13,71.96 49.13,72.25 48.88,72.5 43.2,72.5 v43.15,72.55 | v39.93,72.55 U1.15 | 67.42,78.29 IC1.EXP | v77.55,81.01 C6.1 | v76.92,86.88 77.39,86.41 C7.1 | U1.1 34.27,92.25 v34.13,92.39 | v31.16,92.39 31.16,91.06 30,89.91 26.92,89.91 24.95,91.88 S1.4
  Bottom 0.305: v76.92,89.74 v76.92,86.88 77.39,86.41 77.39,81.17 v77.55,81.01 | v70.88,71.96 69.61,73.23 v69.61,75.45 | v43.15,72.55 v39.93,72.55 | S2.4 S2.3 | v34.13,92.39 v31.16,92.39
  pour Top (isolate 0.305): 16.03,99.54 arc90 12.54,96.04 12.54,71.91 12.54,71.6 arc90 15.72,68.42 19.05,68.42 arc-90 20.48,66.99 20.48,63.98 arc-90 19.05,62.55 17.94,62.55 arc90 0.48,45.09 0.48,6.03 0.48,5.87 arc90 5.87,0.48 93.98,0.48 94.14,0.48 arc90 99.54,5.87 99.54,45.09 arc90 82.07,62.55 80.96,62.55 arc-90 79.53,63.98 79.53,66.99 arc-90 80.96,68.42 84.93,68.42 arc90 87.47,70.96 87.47,96.04 87.47,96.2 arc90 84.14,99.54 16.19,99.54
MPUSCL  (via drill 0.35)  (1 unrouted)
  Top 0.305: MPU6050.3 42.78,56.35 43.91,57.47 54.83,57.47 57.69,60.33 57.69,84.55 v57.47,84.77 | U1.36 52.25,89.72 v52.07,89.53
  Bottom 0.305: v57.47,84.77 52.7,84.77 52.07,85.41 v52.07,89.53
MPUSDA  (1 unrouted)
  Top 0.305: U1.33 58.21,85.91 59.14,84.98 59.14,79.65 58.3,78.82 58.3,59.89 55.24,56.83 46.04,56.83 45.33,56.12 MPU6050.4
N$1
  Top 0.305: R2.1 25,84.18 24.05,83.23 20.24,83.23 18.93,84.54 S1.1 S1.2
N$2
  Top 0.305: R6.1 19.29,78.47 | S2.2 18.93,78.83 | 19.29,78.47 18.93,78.83 | 19.29,78.47 18.93,78.11 | 18.93,78.11 S2.1 | 18.93,78.83 18.93,78.11
N$3  (1 unrouted)
N$4
  Top 0.61: R5.2 17.29,18.15 C2.1 14.16,18.21 D1.C 13.89,19.13 10.68,22.34 VR1.3
N$6  (via drill 0.35)  (1 unrouted)
  Top 0.254: IC1.25 v66.92,73.23
  Top 0.305: U$6.MSP 62.31,87.84 R9.1
  Bottom 0.305: v66.92,73.23 66.92,73.8 66.72,74 66.72,85.81 65.17,87.36 U$6.MSP
N$7
  Top 0.305: R10.1 25.64,97.71 25.08,98.27 23.75,98.27 LED1.A
N$8
  Top 0.61: U2.3 8.41,38.89 9.04,39.52 D2.C 18.1,39.52 18.18,39.45 | R11.2 18.18,39.45 | 18.18,39.45 C8.1
N$9  (via drill 0.35)
  Top 0.254: IC1.26 67.42,75.62 67.87,75.17 v67.87,74.34
  Top 0.305: 23.73,94.09 24.43,93.39 R8.1 v30.09,93.39 | U$7.MSP v59.77,90.53
  Bottom 0.305: v67.87,74.34 67.87,89.58 66.92,90.53 U$7.MSP | v30.09,93.39 56.91,93.39 v59.77,90.53
N$10
  Top 0.254: IC1.7 70.95,80.29 71.36,80.69 71.36,81.96 71.68,82.28 R13.2
  Top 0.305: R13.2 | IC1.6 IC1.7
N$11
  Top 0.254: 68.42,83.95 IC1.8
  Top 0.305: R12.1 69.46,85 68.42,83.95
N$12  (via drill 0.35)
  Top 0.305: R14.2 14.65,94.03 v14.61,93.98 | 16.19,84.12 T2.B 17.22,84.19 v17.49,84.45
  Bottom 0.305: v17.49,84.45 17.49,91.1 v14.61,93.98
N$13
  Top 0.305: U3.10 58.81,25.96 58.49,26.28 R30.1
N$14
  Top 0.305: R15.1 14.24,89.49 14.92,90.17 16.19,90.17 16.58,90.56 T1.B
N$16
  Bottom 0.61: U$15.MSP 53.99,20.91 JP1.2 57.52,20.88 U3.12
N$17
  Bottom 0.61: U3.11 57.52,23.42 JP1.1 53.99,23.45 U$16.MSP
N$18
  Bottom 0.61: U3.13 57.52,18.34 JP1.3 57.39,18.46 U$17.MSP
N$19
  Bottom 0.61: U$18.MSP 57.39,15.92 JP1.4 57.52,15.8 U3.14
N$23  (1 unrouted)
N$24  (1 unrouted)
N$25
  Top 0.305: U1.24 R34.2
N$26
  Top 0.61: U$19.MSP 79.96,28.94 81.28,27.62 81.28,21.59 80.6,20.91 JP2.2
  Bottom 0.61: U5.12 79.06,20.88 JP2.2
N$27
  Top 0.61: U$20.MSP 79.03,26.35 JP2.1
  Bottom 0.61: U5.11 79.06,23.42 JP2.1
N$28
  Top 0.61: JP2.3 80.69,18.37 81.28,17.78 81.28,10.79 80.64,10.16 79.03,10.16 U$22.MSP
  Bottom 0.61: U5.13 79.06,18.34 JP2.3
N$29
  Top 0.61: JP2.4 79.14,15.72 U$21.MSP
  Bottom 0.61: U5.14 79.06,15.8 JP2.4
N$30
  Top 0.305: R3.1 31.99,92.44 32.45,91.98 33.27,91.98 34.27,90.98 U1.2
N$32  (2 unrouted)
N$33  (2 unrouted)
N$34  (2 unrouted)
N$38  (1 unrouted)
N$39
  Top 0.305: U5.10 93.11,25.96 93.5,25.56 93.5,8.41 94.41,7.51 R31.1
N$40
  Top 0.305: U6.10 86.12,47.7 86.73,48.31 R32.1
N$41  (2 unrouted)
N$45  (1 unrouted)
N$46  (1 unrouted)
  Top 0.61: X1.3 26.77,17.36 U$36.MSP
N$49  (1 unrouted)
  Bottom 0.61: U6.12 82.66,42.5 JP4.2
N$50  (1 unrouted)
  Bottom 0.61: U6.11 82.66,45.04 JP4.1
N$51  (1 unrouted)
  Bottom 0.61: U6.13 82.66,39.96 JP4.3
N$52  (1 unrouted)
  Bottom 0.61: U6.14 82.66,37.42 JP4.4
N$56  (1 unrouted)
PIN0  (via drill 0.35)
  Top 0.305: R2.2 R1.2 32.65,82.28 33.26,81.67 v33.26,79.26 | v59.14,78.47 R16.2 | U1.25 54.12,75.72 52.55,75.72 51.99,76.28 v51.99,77.99
  Bottom 0.305: v33.26,79.26 50.72,79.26 v51.99,77.99 52.47,78.47 v59.14,78.47
PIN1  (via drill 0.35)
  Top 0.305: T1.C 14.38,93.02 13.55,93.86 13.55,97.11 v14.4,97.95 | v22.23,95.89 22.68,95.43 22.68,95.36 22.95,95.09 30.05,95.09 v30.92,94.23 | v60.64,85.41 60.64,81.92 v61.91,80.64 | v61.91,74.61 61.52,75.01 R16.1
  Bottom 0.305: v14.4,97.95 20.16,97.95 v22.23,95.89 | v30.92,94.23 57.26,94.23 60.61,90.88 60.61,85.44 v60.64,85.41 | v61.91,80.64 v61.91,74.61
RTS  (via drill 0.35)
  Top 0.254: IC1.24 66.42,74.51
  Top 0.305: 66.42,74.51 66.42,74.16 v65.49,73.23 | R15.2 16.14,87.05 16.26,86.92 T2.E 14.96,86.09 14.95,86.09 14.55,86.09 v13.97,86.68
  Bottom 0.305: v13.97,86.68 14.09,86.56 14.09,82.84 22.24,74.69 22.24,73.32 22.95,72.6 23.96,72.6 24.74,73.38 57.52,73.38 59.46,71.44 60.32,71.44 62.11,73.23 v65.49,73.23
RXD
  Top 0.305: U1.35 55.7,88.44 56.31,87.84 R9.2
STEP1  (via drill 0.35)
  Top 0.305: v38.73,71.44 38.1,71.44 35.24,74.3 35.24,75.25 35.74,75.75 U1.14
  Bottom 0.305: U4.7 73.15,49.21 65.72,49.21 44.77,70.17 40.01,70.17 v38.73,71.44
STEP2  (via drill 0.35)
  Top 0.305: U1.13 36.78,76.65 35.78,76.65 34.63,75.5 34.63,73.64 v38.1,70.17
  Bottom 0.305: v38.1,70.17 39.05,69.22 44.45,69.22 62.2,51.47 62.47,51.47 70.17,43.76 70.17,26.99 71.2,25.96 U3.7
STEP3  (1 unrouted)
STEP4  (via drill 0.35)
  Top 0.305: v62.23,70.48 60.01,72.71 v60.01,77.15 | U1.30 56.02,82.09 v56.52,81.6
  Bottom 0.305: U6.7 91.12,52.07 88.58,52.07 86.68,53.98 84.14,53.98 69.85,68.26 64.45,68.26 v62.23,70.48 | v60.01,77.15 59.97,77.19 59.97,78.82 59.48,79.31 58.81,79.31 v56.52,81.6
TXD  (via drill 0.35)
  Top 0.305: R8.2 v30.24,91.49 | U1.34 51.89,87.17 50.72,88.34 v50.72,89.58
  Bottom 0.305: v30.24,91.49 40.56,91.49 42.47,89.58 v50.72,89.58
VBUS
  Top 0.305: 74.53,92 J1.1 | C7.2 81.87,88.31 82.45,87.72 R35.1
  Top 0.406: 75.17,88.31 74.53,88.95 74.53,92 | 75.17,88.31 75.17,87.68 74.38,86.88 R12.2 | C7.2 75.61,88.31 | 75.25,87.95 75.61,88.31 | 75.61,88.31 75.17,88.31 | R35.1 84.87,86.58 85.41,86.04 85.41,83.66 84.66,82.91 C6.2
VCC  (via drill 0.35)  (4 unrouted)
  Top 1.27: C11.+ 70.92,53.55 72.55,51.91 | 73.34,53.34 75.88,53.34 76.52,53.98 C10.+ 76.52,54.18 77.99,52.7 83.5,52.7 85.41,50.8 v85.41,50.16 | C12.+ 80.85,2.75 80.47,2.36 72.07,2.36 | C12.+ 80.64,5.36 | v70.48,8.89 70.48,5.11 C13.+ 70.59,3.38 71.44,2.54 | C12.+ 80.85,6.87 82.82,8.84 U5.16 | 66.36,32.38 66.28,32.46 U4.16 | 66.04,34.29 64.29,32.54 66.36,30.48
  Top 2.54: 73.66,53.02 72.55,51.91 66.36,45.72 66.36,32.38 66.36,5.71 63.77,3.12 64.53,2.36 72.07,2.36
  Top 4.064: X1.5 36.8,4.15 37.83,3.12 63.77,3.12
  Bottom 1.27: U3.16 68.66,10.72 v70.48,8.89 | v85.41,50.16 85.41,33.34 84.53,32.46 U6.16

### Text on the board
tValues: 9V+
bValues: Francesco Lanthaler / BeeBeeAte - 1. Board / 5AEL TFO Meran 2021/22